# Altium schematic sheet MainBoard.SchDoc
size A3
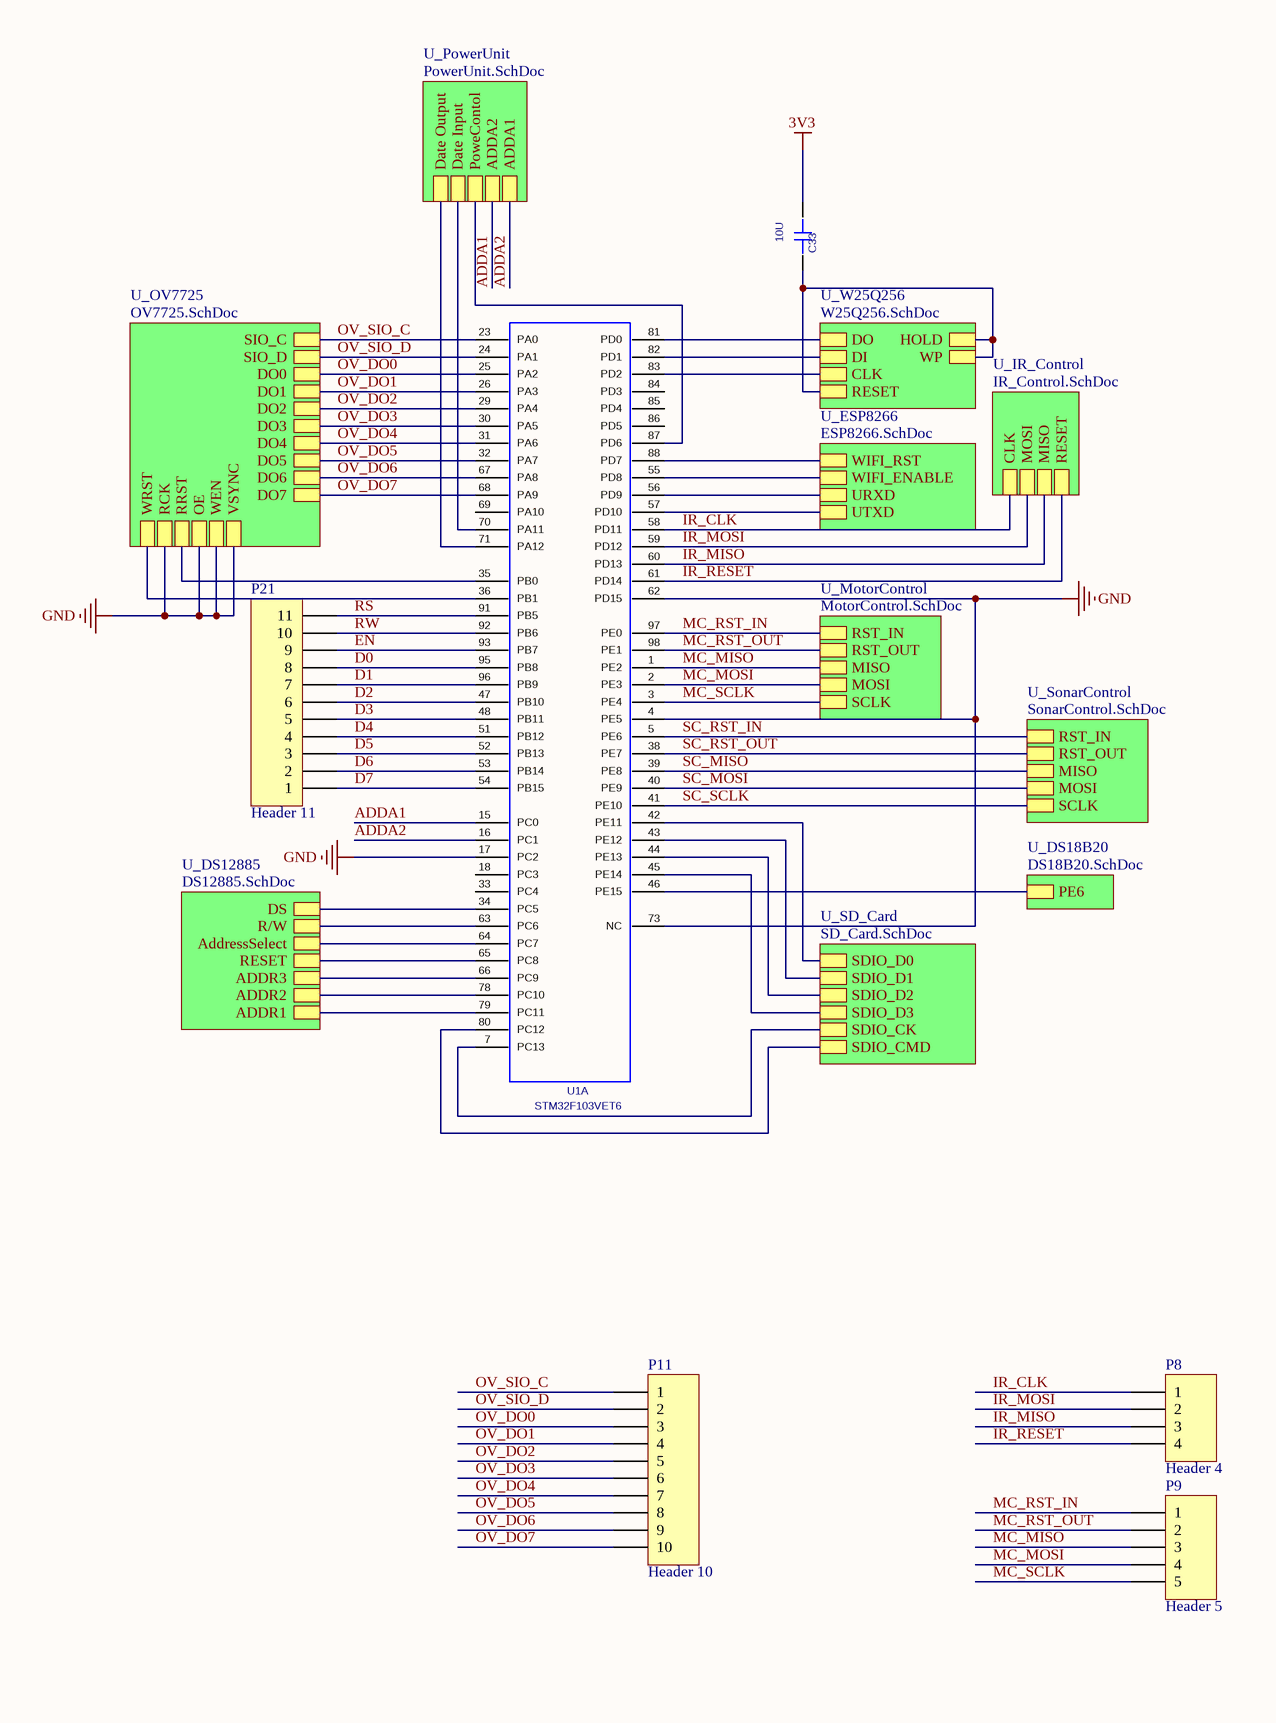
[diagram p0: MainBoard.SchDoc, left]
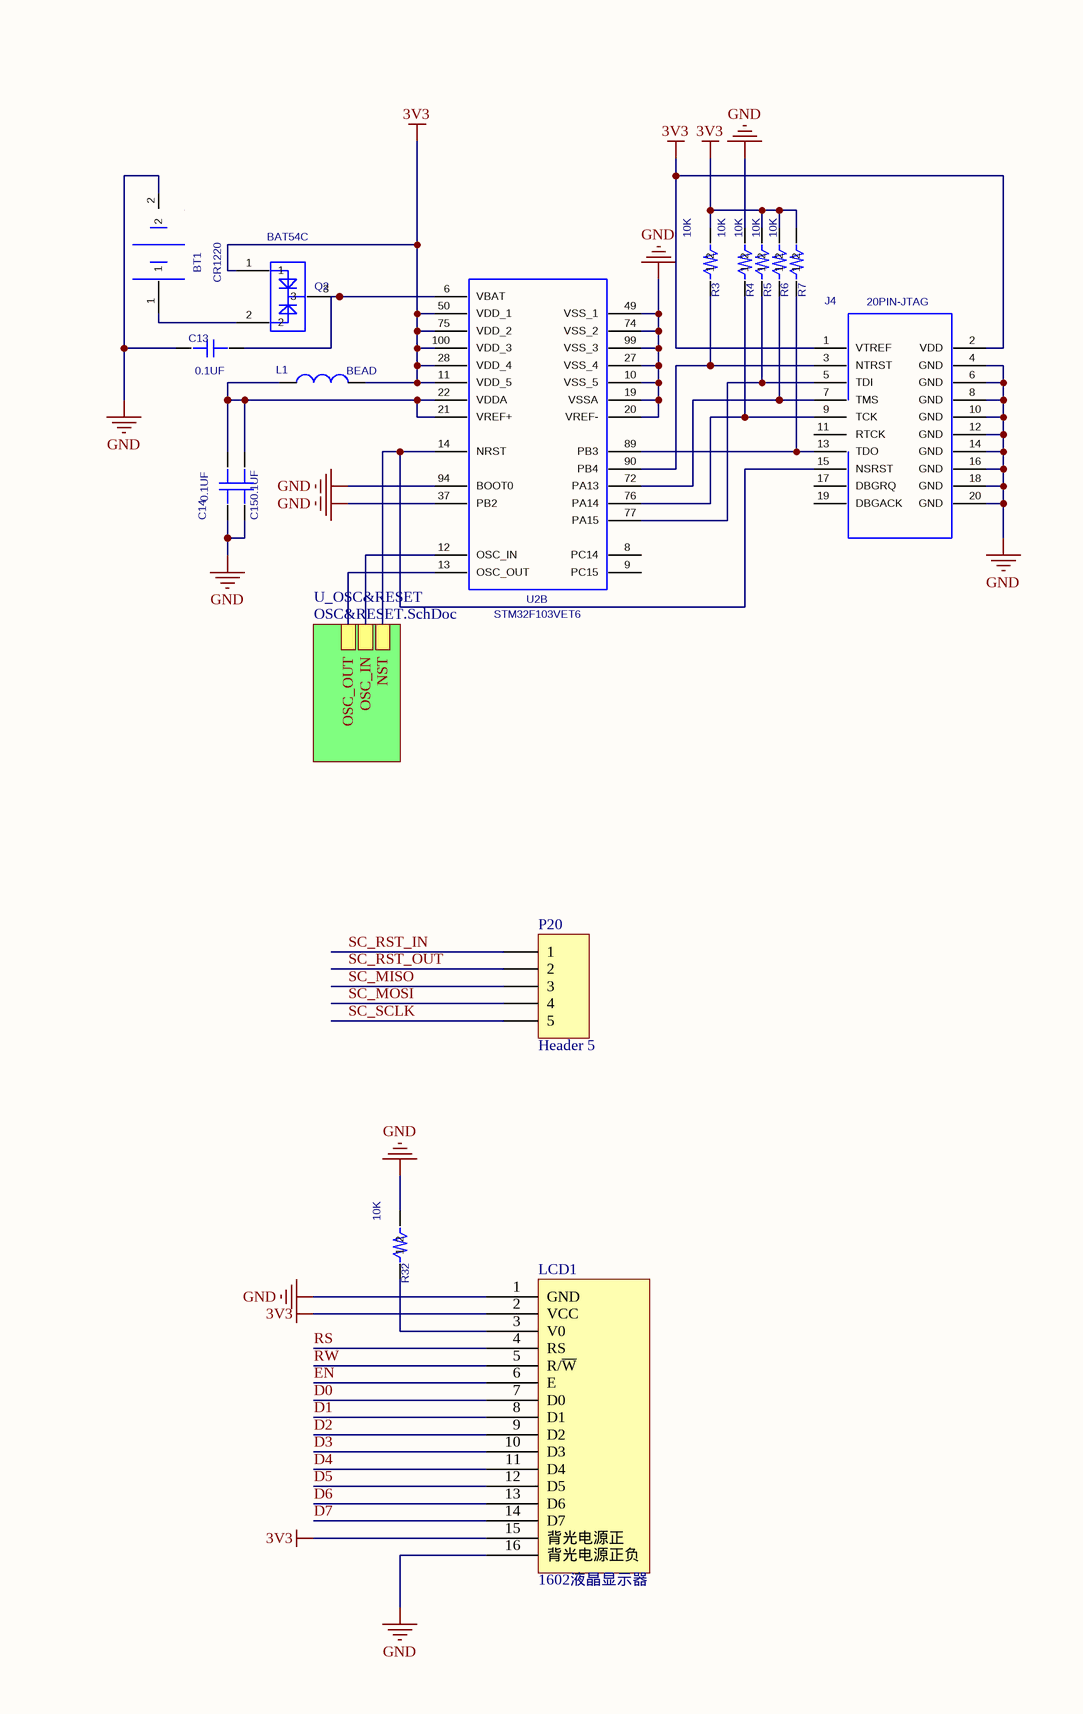
[diagram p1: MainBoard.SchDoc, right]

## Parts
BT1  CR1220  [BATERY]
C13  value 0.1UF  [CAP_0603_FIRE]  (hidden comment: CAP_0.1UF_0603_FIRE)
C14  value 0.1UF  [CAP_0603_FIRE]  (hidden comment: CAP_0.1UF_0603_FIRE)
C15  value 0.1UF  [CAP_0603_FIRE]  (hidden comment: CAP_0.1UF_0603_FIRE)
C33  value 10U  [CAP_0603_FIRE]  (hidden comment: C_10UF_0603)
J4  20PIN-JTAG  [FC20H]
L1  value BEAD  [L0603]  (hidden comment: BEAD-220/100MHZ-0603)
LCD1  1602液晶显示器  [LCD1602A]
P8  Header 4  [HDR1X4]
P9  Header 5  [HDR1X5]
P11  Header 10  [HDR1X10]
P20  Header 5  [HDR1X5]
P21  Header 11  [HDR1X11]
Q2  BAT54C  [SOT-23]
R3  value 10K  [RES_0603_FIRE]  (hidden comment: RES_10K_0603_FIRE)
R4  value 10K  [RES_0603_FIRE]  (hidden comment: RES_10K_0603_FIRE)
R5  value 10K  [RES_0603_FIRE]  (hidden comment: RES_10K_0603_FIRE)
R6  value 10K  [RES_0603_FIRE]  (hidden comment: RES_10K_0603_FIRE)
R7  value 10K  [RES_0603_FIRE]  (hidden comment: RES_10K_0603_FIRE)
R32  value 10K  [RES_0603_FIRE]  (hidden comment: RES_10K_0603_FIRE)
U1  STM32F103VET6  [STM32F103VET6-LQFP]  (part A of 2)
U2  STM32F103VET6  [STM32F103VET6-LQFP]  (part B of 2)

## Sub-sheets
U_DS18B20 = DS18B20.SchDoc: PE6
U_DS12885 = DS12885.SchDoc: ADDR1, ADDR2, ADDR3, RESET, AddressSelect, R/W, DS
U_ESP8266 = ESP8266.SchDoc: WIFI_RST, WIFI_ENABLE, URXD, UTXD
U_IR_Control = IR_Control.SchDoc: CLK, MOSI, MISO, RESET
U_MotorControl = MotorControl.SchDoc: RST_IN, RST_OUT, MISO, MOSI, SCLK
U_OSC&RESET = OSC&RESET.SchDoc: NST, OSC_IN, OSC_OUT
U_OV7725 = OV7725.SchDoc: SIO_C, VSYNC, WRST, RCK, RRST, OE, WEN, SIO_D, DO7, DO0, DO1, DO2, DO3, DO4, DO5, DO6
U_PowerUnit = PowerUnit.SchDoc: Date Output, Date Input, PoweContol, ADDA2, ADDA1
U_SD_Card = SD_Card.SchDoc: SDIO_D0, SDIO_D1, SDIO_D2, SDIO_D3, SDIO_CK, SDIO_CMD
U_SonarControl = SonarControl.SchDoc: RST_IN, RST_OUT, MISO, MOSI, SCLK
U_W25Q256 = W25Q256.SchDoc: HOLD, RESET, DO, DI, WP, CLK

## Nets
3V3: C33.2 J4.1(VTREF) J4.2(VDD) L1.2 LCD1.2(VCC) LCD1.15(背光电源正) Q2.1 R3.2 R5.2 R6.2 R7.2 U2.11(VDD_5) U2.28(VDD_4) U2.50(VDD_1) U2.75(VDD_2) U2.100(VDD_3)
GND: BT1.2 C13.2 C14.1 C15.1 J4.4(GND) J4.6(GND) J4.8(GND) J4.10(GND) J4.12(GND) J4.14(GND) J4.16(GND) J4.18(GND) J4.20(GND) LCD1.1(GND) LCD1.16(背光电源正负) R4.2 R32.2 U1.4(PE5) U1.17(PC2) U1.62(PD15) U1.73(NC) U2.10(VSS_5) U2.19(VSSA) U2.20(VREF-) U2.27(VSS_4) U2.37(PB2) U2.49(VSS_1) U2.74(VSS_2) U2.94(BOOT0) U2.99(VSS_3) ; sheet U_OV7725/VSYNC, sheet U_OV7725/RCK, sheet U_OV7725/OE, sheet U_OV7725/WEN
ADDA1: U1.15(PC0) ; sheet U_PowerUnit/ADDA2
ADDA2: U1.16(PC1) ; sheet U_PowerUnit/ADDA1
D0: LCD1.7(D0) P21.8 U1.95(PB8)
D1: LCD1.8(D1) P21.7 U1.96(PB9)
D2: LCD1.9(D2) P21.6 U1.47(PB10)
D3: LCD1.10(D3) P21.5 U1.48(PB11)
D4: LCD1.11(D4) P21.4 U1.51(PB12)
D5: LCD1.12(D5) P21.3 U1.52(PB13)
D6: LCD1.13(D6) P21.2 U1.53(PB14)
D7: LCD1.14(D7) P21.1 U1.54(PB15)
EN: LCD1.6(E) P21.9 U1.93(PB7)
IR_CLK: P8.1 U1.58(PD11) ; sheet U_IR_Control/CLK
IR_MISO: P8.3 U1.60(PD13) ; sheet U_IR_Control/MISO
IR_MOSI: P8.2 U1.59(PD12) ; sheet U_IR_Control/MOSI
IR_RESET: P8.4 U1.61(PD14) ; sheet U_IR_Control/RESET
MC_MISO: P9.3 U1.1(PE2) ; sheet U_MotorControl/MISO
MC_MOSI: P9.4 U1.2(PE3) ; sheet U_MotorControl/MOSI
MC_RST_IN: P9.1 U1.97(PE0) ; sheet U_MotorControl/RST_IN
MC_RST_OUT: P9.2 U1.98(PE1) ; sheet U_MotorControl/RST_OUT
MC_SCLK: P9.5 U1.3(PE4) ; sheet U_MotorControl/SCLK
OV_DO0: P11.3 U1.25(PA2) ; sheet U_OV7725/DO0
OV_DO1: P11.4 U1.26(PA3) ; sheet U_OV7725/DO1
OV_DO2: P11.5 U1.29(PA4) ; sheet U_OV7725/DO2
OV_DO3: P11.6 U1.30(PA5) ; sheet U_OV7725/DO3
OV_DO4: P11.7 U1.31(PA6) ; sheet U_OV7725/DO4
OV_DO5: P11.8 U1.32(PA7) ; sheet U_OV7725/DO5
OV_DO6: P11.9 U1.67(PA8) ; sheet U_OV7725/DO6
OV_DO7: P11.10 U1.68(PA9) ; sheet U_OV7725/DO7
OV_SIO_C: P11.1 U1.23(PA0) ; sheet U_OV7725/SIO_C
OV_SIO_D: P11.2 U1.24(PA1) ; sheet U_OV7725/SIO_D
RS: LCD1.4(RS) P21.11 U1.91(PB5)
RW: LCD1.5(R/~{W}) P21.10 U1.92(PB6)
SC_MISO: P20.3 U1.39(PE8) ; sheet U_SonarControl/MISO
SC_MOSI: P20.4 U1.40(PE9) ; sheet U_SonarControl/MOSI
SC_RST_IN: P20.1 U1.5(PE6) ; sheet U_SonarControl/RST_IN
SC_RST_OUT: P20.2 U1.38(PE7) ; sheet U_SonarControl/RST_OUT
SC_SCLK: P20.5 U1.41(PE10) ; sheet U_SonarControl/SCLK
NetBT1_1: BT1.1 Q2.2
NetC13_1: C13.1 Q2.3 U2.6(VBAT)
NetC14_2: C14.2 C15.2 L1.1 U2.21(VREF+) U2.22(VDDA)
NetC33_1: C33.1 ; sheet U_W25Q256/HOLD, sheet U_W25Q256/RESET, sheet U_W25Q256/WP
NetJ4_3: J4.3(NTRST) R3.1 U2.90(PB4)
NetJ4_5: J4.5(TDI) R5.1 U2.77(PA15)
NetJ4_7: J4.7(TMS) R6.1 U2.72(PA13)
NetJ4_9: J4.9(TCK) R4.1 U2.76(PA14)
NetJ4_13: J4.13(TDO) R7.1 U2.89(PB3)
NetJ4_15: J4.15(NSRST) U2.14(NRST) ; sheet U_OSC&RESET/NST
NetLCD1_3: LCD1.3(V0) R32.1
NetU1_7: U1.7(PC13) ; sheet U_SD_Card/SDIO_CK
NetU1_34: U1.34(PC5) ; sheet U_DS12885/DS
NetU1_35: U1.35(PB0) ; sheet U_OV7725/RRST
NetU1_36: U1.36(PB1) ; sheet U_OV7725/WRST
NetU1_42: U1.42(PE11) ; sheet U_SD_Card/SDIO_D0
NetU1_43: U1.43(PE12) ; sheet U_SD_Card/SDIO_D1
NetU1_44: U1.44(PE13) ; sheet U_SD_Card/SDIO_D2
NetU1_45: U1.45(PE14) ; sheet U_SD_Card/SDIO_D3
NetU1_46: U1.46(PE15) ; sheet U_DS18B20/PE6
NetU1_55: U1.55(PD8) ; sheet U_ESP8266/WIFI_ENABLE
NetU1_56: U1.56(PD9) ; sheet U_ESP8266/URXD
NetU1_57: U1.57(PD10) ; sheet U_ESP8266/UTXD
NetU1_63: U1.63(PC6) ; sheet U_DS12885/R/W
NetU1_64: U1.64(PC7) ; sheet U_DS12885/AddressSelect
NetU1_65: U1.65(PC8) ; sheet U_DS12885/RESET
NetU1_66: U1.66(PC9) ; sheet U_DS12885/ADDR3
NetU1_70: U1.70(PA11) ; sheet U_PowerUnit/Date Input
NetU1_71: U1.71(PA12) ; sheet U_PowerUnit/Date Output
NetU1_78: U1.78(PC10) ; sheet U_DS12885/ADDR2
NetU1_79: U1.79(PC11) ; sheet U_DS12885/ADDR1
NetU1_80: U1.80(PC12) ; sheet U_SD_Card/SDIO_CMD
NetU1_81: U1.81(PD0) ; sheet U_W25Q256/DO
NetU1_82: U1.82(PD1) ; sheet U_W25Q256/DI
NetU1_83: U1.83(PD2) ; sheet U_W25Q256/CLK
NetU1_87: U1.87(PD6) ; sheet U_PowerUnit/PoweContol
NetU1_88: U1.88(PD7) ; sheet U_ESP8266/WIFI_RST
NetU2_12: U2.12(OSC_IN) ; sheet U_OSC&RESET/OSC_IN
NetU2_13: U2.13(OSC_OUT) ; sheet U_OSC&RESET/OSC_OUT

Not connected (* = marked no-connect by the designer): J4 11(RTCK) 17(DBGRQ) 19(DBGACK); U1 18(PC3) 33(PC4) 69(PA10) 84(PD3) 85(PD4) 86(PD5); U2 8(PC14) 9(PC15)

## Library data of the parts
C13-C15 = CAP_0.1UF_0603_FIRE: SURFACE MOUNT CAPACITOR 0.031 X 0.061 INCHES; PCB DECAL: CAP_0603_FIRE
J4 = 20PIN-JTAG: 20pin JTAG; Manufacturer #1: 20pin JTAG; Manufacturer #1 PN: 20pin JTAG; Value: 20pin JTAG; PCB DECAL: FC20H
L1 = BEAD-220/100MHZ-0603: 0603,BEAD; Manufacturer #1 PN: BEAD; PCB DECAL: L0603
P8 = Header 4: Header, 4-Pin; LatestRevisionDate: 17-Jul-2002; LatestRevisionNote: Re-released for DXP Platform.; Publisher: Altium Limited
P9 P20 = Header 5: Header, 5-Pin; LatestRevisionDate: 17-Jul-2002; LatestRevisionNote: Re-released for DXP Platform.; Publisher: Altium Limited
P11 = Header 10: Header, 10-Pin; LatestRevisionDate: 17-Jul-2002; LatestRevisionNote: Re-released for DXP Platform.; Publisher: Altium Limited
P21 = Header 11: Header, 11-Pin; LatestRevisionDate: 17-Jul-2002; LatestRevisionNote: Re-released for DXP Platform.; Publisher: Altium Limited
R3-R7 R32 = RES_10K_0603_FIRE: SURFACE MOUNT RESISTOR 0.031 X 0.061 INCHES, 1/10W; Assembly: SMD; PCB DECAL: RES_0603_FIRE
U1 U2 = STM32F103VET6: Geometry.Height: 62.99mil; Protel.FootprintDescription: TSQFP, 100-Leads, Body 16.2x16.2mm (max), Pitch 0.50mm, IP; Value: STM32F103VET6; PCB DECAL: STM32F103VET6-LQFP
BT1 = CR1220: PCB DECAL: BATERY
C33 = C_10UF_0603: PCB DECAL: CAP_0603_FIRE
Q2 = BAT54C: Value: BAT54C; PCB DECAL: SOT-23